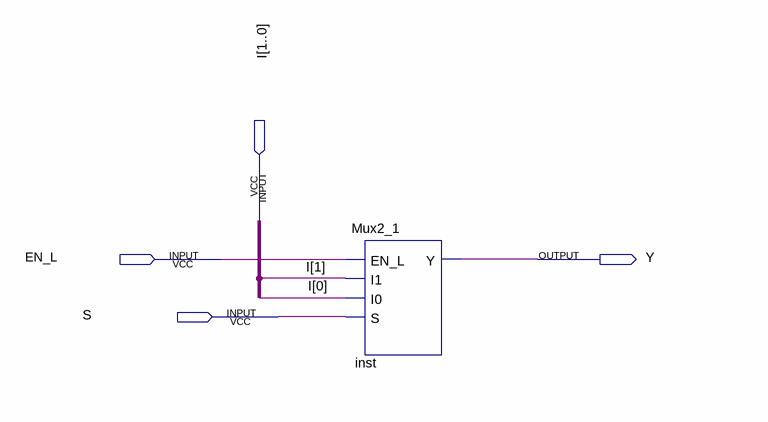
[diagram p0: schematic sheet]
// Quartus schematic MuxDemo.bdf as structural Verilog: 1 symbols, 4 pins
module MuxDemo (
  input  [1:0] I,
  input  EN_L,
  input  S,
  output Y
);

  Mux2_1 inst (.EN_L(EN_L), .I1(I[1]), .I0(I[0]), .S(S), .Y(Y));
endmodule
